# EAGLE board ewheel32 (EAGLE 7.7.0), part 1 of 2
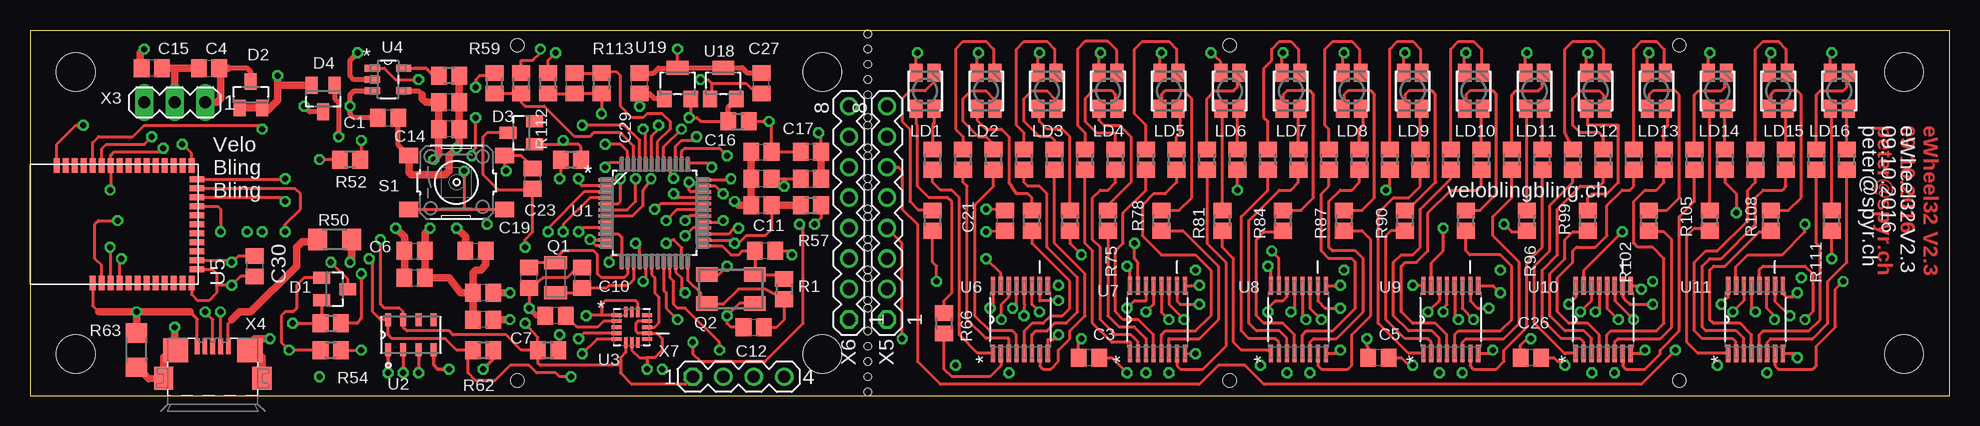
[diagram p2: board, top side]
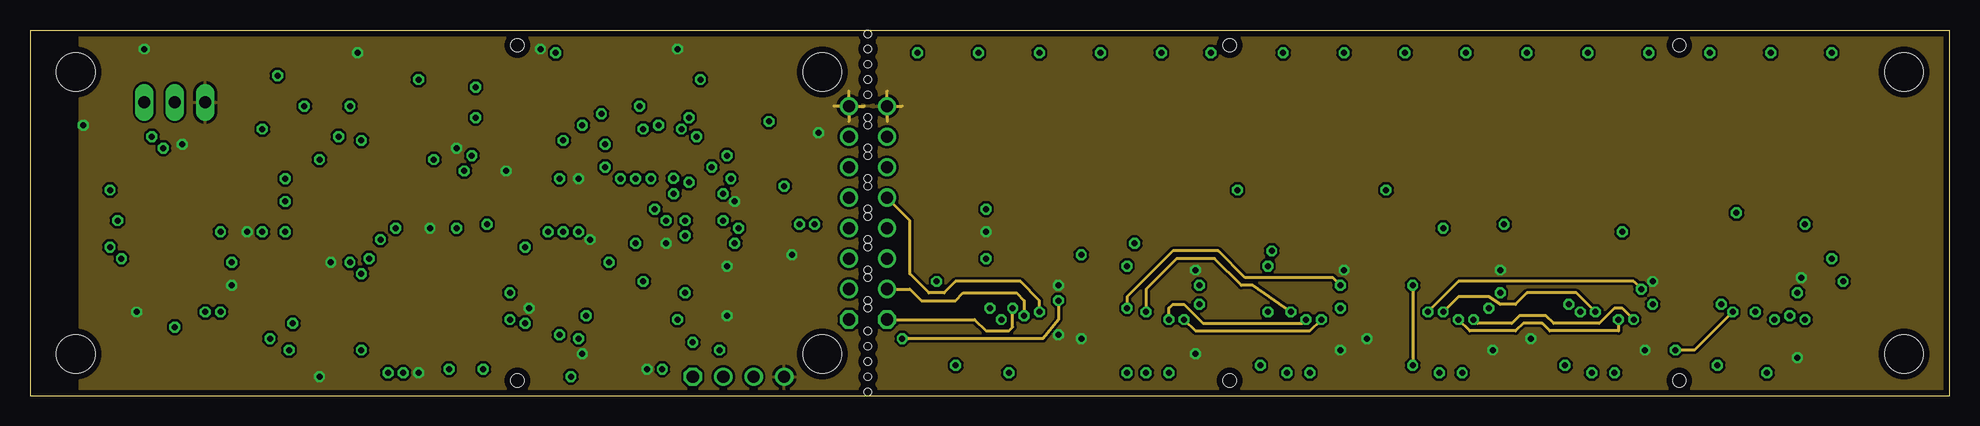
[diagram p3: board, inner layer GROUND]
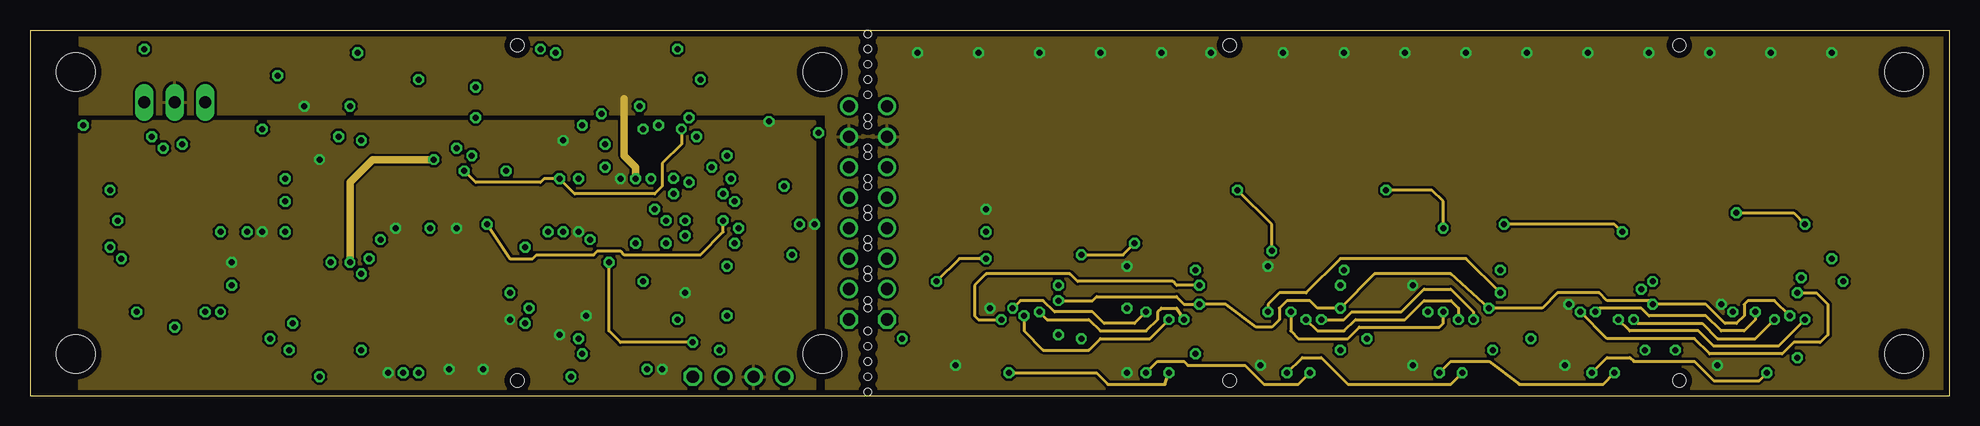
[diagram p4: board, inner layer POWER]
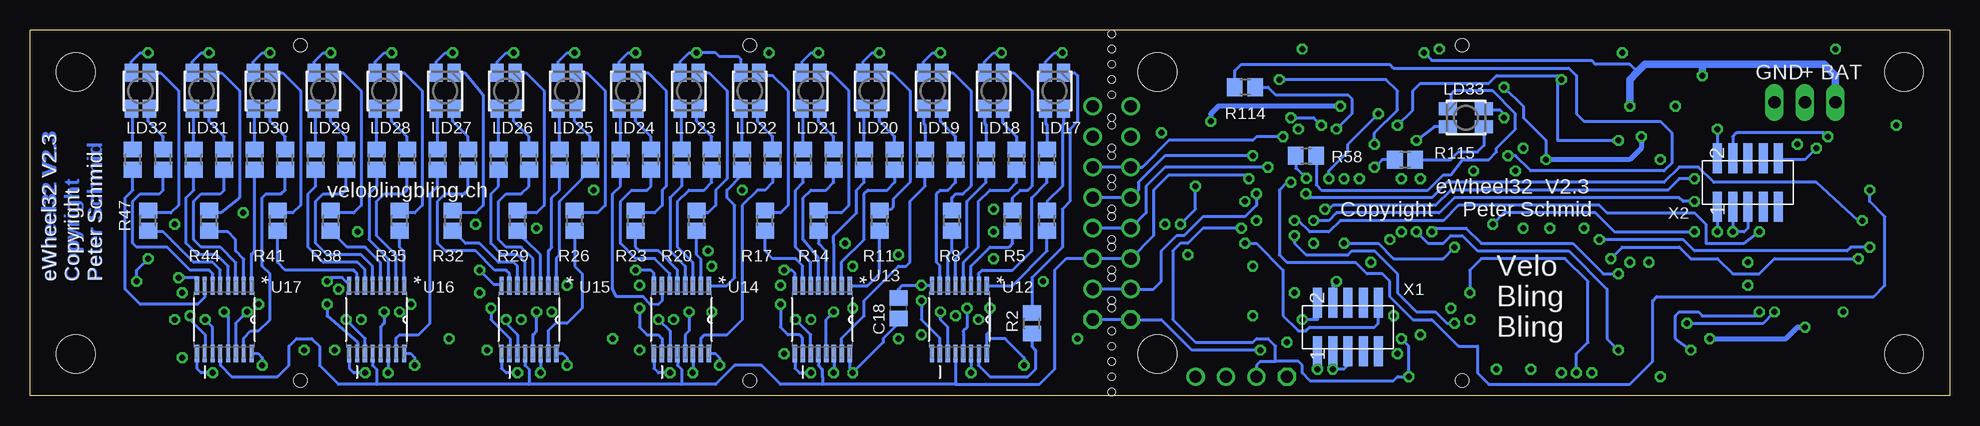
[diagram p5: board, bottom side, seen from below]

Size 160.02 x 30.48 mm. Coordinates in mm from the lower left corner, seen from the top.
Outline: 0,0 160.02,0 160.02,30.48 0,30.48 0,0
Copper layers (1+2*3+16): Top 0.035mm / dielectric 0.36mm / GROUND 0.035mm / dielectric 0.36mm / POWER 0.035mm / dielectric 0.36mm / Bottom 0.035mm
Design rules "default *": minimum track width 8mil, minimum drill 16mil, track to track 8mil, track to pad 8mil, pad to pad 8mil, via to via 8mil, smd to smd 8mil, copper to edge 20mil, drill to drill 8mil, minimum pad ring 10mil, minimum via ring 8mil, stop-mask expansion 4mil, vias tented up to drill 0mil, thermal gap 10mil
Net classes: 0 default: width 0.254 mm; 1 gnd: width 0.254 mm; 2 power: width 0.254 mm
Holes 3.2 mm at 3.81,3.49 3.81,26.99 156.21,3.49 156.21,26.99 66.04,3.49 66.04,26.99
Holes 1.1 mm at 40.64,29.21 40.64,1.27 100.01,29.21 100.01,1.27 137.48,29.21 137.48,1.27
Holes 0.6 mm at 69.85,25.08 69.85,22.54 69.85,20.64 69.85,18.1 69.85,15.56 69.85,13.02 69.85,10.48 69.85,7.94 69.85,26.35 69.85,27.62 69.85,4.13 69.85,2.86 69.85,28.89 69.85,30.16 69.85,23.18 69.85,20 69.85,17.46 69.85,14.92 69.85,12.38 69.85,9.84 69.85,7.3 69.85,1.59 69.85,0.32 69.85,5.4

## Footprints (pad centres in the part's own frame; a part is rotated, then mirrored left to right if it is on the bottom)
C0805 = smd 1.3 x 1.5: 1 -0.85,0; 2 0.85,0
SOT23 = smd 1 x 1.4: 1 -0.95,-1.1; 2 0.95,-1.1; 3 0,1.1
RGBLED-PLCC4 = smd 1.5 x 1.1: 1 -1.5,0.75; 2 -1.5,-0.75; 3 1.5,-0.75; 4 1.5,0.75
ABS07 = smd 1.1 x 1.9: P$1 -1.25,0; P$2 1.25,0
ABM3B = smd 1.8 x 1.2: 1 -1.993,-1.2; 2 1.993,-1.2; 3 1.993,1.2; 4 -1.993,1.2
R0805 = smd 1.3 x 1.5: 1 -0.85,0; 2 0.85,0
R1206 = smd 1.6 x 1.803: 1 -1.422,0; 2 1.422,0
B3S-1000 = smd 1.55 x 1.3: 1 -4,2.25; 2 4,2.25; 3 -4,-2.25; 4 4,-2.25
QFP50P900X900X160-48N = smd 1.041 x 0.279: 1 -4.166,2.743; 2 -4.166,2.261; 3 -4.166,1.753; 4 -4.166,1.245; 5 -4.166,0.762; 6 -4.166,0.254; 7 -4.166,-0.254; 8 -4.166,-0.762; 9 -4.166,-1.245; 10 -4.166,-1.753; 11 -4.166,-2.261; 12 -4.166,-2.743; 25 4.166,-2.743; 26 4.166,-2.261; 27 4.166,-1.753; 28 4.166,-1.245; 29 4.166,-0.762; 30 4.166,-0.254; 31 4.166,0.254; 32 4.166,0.762; 33 4.166,1.245; 34 4.166,1.753; 35 4.166,2.261; 36 4.166,2.743 | smd 0.279 x 1.041: 13 -2.743,-4.166; 14 -2.261,-4.166; 15 -1.753,-4.166; 16 -1.245,-4.166; 17 -0.762,-4.166; 18 -0.254,-4.166; 19 0.254,-4.166; 20 0.762,-4.166; 21 1.245,-4.166; 22 1.753,-4.166; 23 2.261,-4.166; 24 2.743,-4.166; 37 2.743,4.166; 38 2.261,4.166; 39 1.753,4.166; 40 1.245,4.166; 41 0.762,4.166; 42 0.254,4.166; 43 -0.254,4.166; 44 -0.762,4.166; 45 -1.245,4.166; 46 -1.753,4.166; 47 -2.261,4.166; 48 -2.743,4.166
DFN300X500X120-8N = smd 1.092 x 0.508: 1 -1.245,1.88; 2 -1.245,0.635; 3 -1.245,-0.635; 4 -1.245,-1.88; 5 1.245,-1.88; 6 1.245,-0.635; 7 1.245,0.635; 8 1.245,1.88
QFN50P300X300X100-16N = smd 0.864 x 0.305: 1 -1.27,0.991; 2 -1.27,0.508; 3 -1.27,0; 4 -1.27,-0.508; 5 -1.27,-0.991; 9 1.27,-0.991; 10 1.27,-0.508; 11 1.27,0; 12 1.27,0.508; 13 1.27,0.991 | smd 0.305 x 0.864: 6 -0.508,-1.27; 7 0,-1.27; 8 0.508,-1.27; 14 0.508,1.27; 15 0,1.27; 16 -0.508,1.27
SOT95P280X145-5N = smd 1.27 x 0.559: 1 -1.295,0.94; 2 -1.295,0; 3 -1.295,-0.94; 4 1.295,-0.94; 5 1.295,0.94
BL652 = smd 1.2 x 0.5: 1 4.9,4.8; 2 4.9,4.05; 3 4.9,3.3; 4 4.9,2.55; 5 4.9,1.8; 6 4.9,1.05; 7 4.9,0.3; 8 4.9,-0.45; 9 4.9,-1.2; 10 4.9,-1.95; 11 4.9,-2.7; 12 4.9,-3.45; 13 4.9,-4.2; 14 4.9,-4.95; 15 4.9,-5.7; 16 4.9,-6.45; 28 -4.9,-6.45; 29 -4.9,-5.7; 30 -4.9,-4.95; 31 -4.9,-4.2; 32 -4.9,-3.45; 33 -4.9,-2.7; 34 -4.9,-1.95; 35 -4.9,-1.2; 36 -4.9,-0.45; 37 -4.9,0.3; 38 -4.9,1.05; 39 -4.9,1.8 | smd 0.5 x 1.2: 17 3.75,-6.9; 18 3,-6.9; 19 2.25,-6.9; 20 1.5,-6.9; 21 0.75,-6.9; 22 0,-6.9; 23 -0.75,-6.9; 24 -1.5,-6.9; 25 -2.25,-6.9; 26 -3,-6.9; 27 -3.75,-6.9
SOP65P640X120-16N = smd 1.473 x 0.356: 1 -2.819,2.286; 2 -2.819,1.626; 3 -2.819,0.965; 4 -2.819,0.33; 5 -2.819,-0.33; 6 -2.819,-0.965; 7 -2.819,-1.626; 8 -2.819,-2.286; 9 2.819,-2.286; 10 2.819,-1.626; 11 2.819,-0.965; 12 2.819,-0.33; 13 2.819,0.33; 14 2.819,0.965; 15 2.819,1.626; 16 2.819,2.286
SOT23-W = smd 1.2 x 1.4: 1 -1.1,-1.3; 2 1.1,-1.3 | smd 1.8 x 1.2: 3 0,1.3
PIN-HEADER-NICRO-2-5-SMD = smd 2.5 x 0.75: P$1 -2.02,2.54; P$2 2.02,2.54; P$3 -2.02,1.27; P$4 2.02,1.27; P$5 -2.02,0; P$6 2.02,0; P$7 -2.02,-1.27; P$8 2.02,-1.27; P$9 -2.02,-2.54; P$10 2.02,-2.54
MA03-1 = drill 1.016 long: 1 -2.54,0; 2 0,0; 3 2.54,0
ZX62R-B-5P = smd 1.35 x 0.4: 1 2.675,-1.3; 2 2.675,-0.65; 3 2.675,0; 4 2.675,0.65; 5 2.675,1.3 | smd 1.9 x 1.6: M1 0,-4.1; M2 0,4.1 | smd 2 x 2.1: M3 2.35,3.1; M4 2.35,-3.1
MA08-1 = drill 1.016 octagon: 1 -8.89,0 | drill 1.016: 2 -6.35,0; 3 -3.81,0; 4 -1.27,0; 5 1.27,0; 6 3.81,0; 7 6.35,0; 8 8.89,0
MA04-1 = drill 1.016 octagon: 1 -3.81,0 | drill 1.016: 2 -1.27,0; 3 1.27,0; 4 3.81,0

## Placement (x,y rotation side)
C1  4.7u  [C0805]  29.84,23.18 0 top
C2  4.7u  [C0805]  34.92,24.45 180 top
C3  100n  [C0805]  88.27,3.17 180 top
C4  4.7u  [C0805]  14.92,27.3 0 top
C5  100n  [C0805]  112.39,3.17 180 top
C6  4.7u  [C0805]  32.07,12.06 0 top
C7  100n  [C0805]  37.78,6.35 180 top
C8  100n  [C0805]  37.78,8.57 180 top
C9  12p  [C0805]  41.59,9.84 90 top
C10  12p  [C0805]  46.04,9.84 270 top
C11  100n  [C0805]  60.96,15.88 180 top
C12  22p  [C0805]  60.33,5.71 0 top
C13  22p  [C0805]  61.28,12.06 180 top
C14  100n  [C0805]  34.92,22.23 180 top
C15  100n  [C0805]  10.16,27.3 180 top
C16  4.7u  [C0805]  60.96,20.32 0 top
C17  100n  [C0805]  65.09,20.32 180 top
C18  4.7u  [C0805]  87.63,7.3 90 bottom
C19  4.7u  [C0805]  37.15,12.06 0 top
C20  100n  [C0805]  45.4,26.04 90 top
C21  4.7u  [C0805]  81.28,14.61 270 top
C22  4.7u  [C0805]  60.96,18.1 180 top
C23  4.7u  [C0805]  41.91,18.1 90 top
C24  100n  [C0805]  65.09,18.1 0 top
C25  4.7u  [C0805]  32.07,9.84 0 top
C26  100n  [C0805]  125.09,3.17 180 top
C27  100n  [C0805]  60.96,26.04 90 top
C28  100n  [C0805]  43.81,6.67 180 top
C29  100n  [C0805]  50.8,26.04 90 top
C30  100n  [C0805]  18.73,10.79 270 top
D1  GSOT05C-E308  [SOT23]  25.4,8.89 270 top
D2  GSOT05C-E308  [SOT23]  18.41,25.08 0 top
D3  BAT54C  [SOT23]  40.96,21.91 90 top
D4  BAT54C  [SOT23]  24.45,24.77 180 top
LD1  CLV1A-FKB  [RGBLED-PLCC4]  74.61,25.4 270 top
LD2  CLV1A-FKB  [RGBLED-PLCC4]  79.69,25.4 270 top
LD3  CLV1A-FKB  [RGBLED-PLCC4]  84.77,25.4 270 top
LD4  CLV1A-FKB  [RGBLED-PLCC4]  89.85,25.4 270 top
LD5  CLV1A-FKB  [RGBLED-PLCC4]  94.93,25.4 270 top
LD6  CLV1A-FKB  [RGBLED-PLCC4]  100.01,25.4 270 top
LD7  CLV1A-FKB  [RGBLED-PLCC4]  105.09,25.4 270 top
LD8  CLV1A-FKB  [RGBLED-PLCC4]  110.17,25.4 270 top
LD9  CLV1A-FKB  [RGBLED-PLCC4]  115.25,25.4 270 top
LD10  CLV1A-FKB  [RGBLED-PLCC4]  120.33,25.4 270 top
LD11  CLV1A-FKB  [RGBLED-PLCC4]  125.41,25.4 270 top
LD12  CLV1A-FKB  [RGBLED-PLCC4]  130.49,25.4 270 top
LD13  CLV1A-FKB  [RGBLED-PLCC4]  135.57,25.4 270 top
LD14  CLV1A-FKB  [RGBLED-PLCC4]  140.65,25.4 270 top
LD15  CLV1A-FKB  [RGBLED-PLCC4]  145.73,25.4 270 top
LD16  CLV1A-FKB  [RGBLED-PLCC4]  150.81,25.4 270 top
LD17  CLV1A-FKB  [RGBLED-PLCC4]  74.61,25.4 270 bottom
LD18  CLV1A-FKB  [RGBLED-PLCC4]  79.69,25.4 270 bottom
LD19  CLV1A-FKB  [RGBLED-PLCC4]  84.77,25.4 270 bottom
LD20  CLV1A-FKB  [RGBLED-PLCC4]  89.85,25.4 270 bottom
LD21  CLV1A-FKB  [RGBLED-PLCC4]  94.93,25.4 270 bottom
LD22  CLV1A-FKB  [RGBLED-PLCC4]  100.01,25.4 270 bottom
LD23  CLV1A-FKB  [RGBLED-PLCC4]  105.09,25.4 270 bottom
LD24  CLV1A-FKB  [RGBLED-PLCC4]  110.17,25.4 270 bottom
LD25  CLV1A-FKB  [RGBLED-PLCC4]  115.25,25.4 270 bottom
LD26  CLV1A-FKB  [RGBLED-PLCC4]  120.33,25.4 270 bottom
LD27  CLV1A-FKB  [RGBLED-PLCC4]  125.41,25.4 270 bottom
LD28  CLV1A-FKB  [RGBLED-PLCC4]  130.49,25.4 270 bottom
LD29  CLV1A-FKB  [RGBLED-PLCC4]  135.57,25.4 270 bottom
LD30  CLV1A-FKB  [RGBLED-PLCC4]  140.65,25.4 270 bottom
LD31  CLV1A-FKB  [RGBLED-PLCC4]  145.73,25.4 270 bottom
LD32  CLV1A-FKB  [RGBLED-PLCC4]  150.81,25.4 270 bottom
LD33  CLV1A-FKB  [RGBLED-PLCC4]  40.32,23.18 0 bottom
Q1  32.768kHz  [ABS07]  43.81,9.84 90 top
Q2  8MHz  [ABM3B]  58.42,8.89 180 top
R1  1.0M  [R0805]  62.87,8.89 270 top
R2  220  [R0805]  76.52,6.03 90 bottom
R3  220  [R0805]  75.25,14.61 90 bottom
R4  220  [R0805]  75.25,19.68 90 bottom
R5  220  [R0805]  78.11,14.61 90 bottom
R6  220  [R0805]  77.79,19.68 90 bottom
R7  220  [R0805]  80.33,19.68 90 bottom
R8  220  [R0805]  83.19,14.61 90 bottom
R9  220  [R0805]  82.87,19.68 90 bottom
R10  220  [R0805]  85.41,19.68 90 bottom
R11  220  [R0805]  89.22,14.61 90 bottom
R12  220  [R0805]  87.95,19.68 90 bottom
R13  220  [R0805]  90.49,19.68 90 bottom
R14  220  [R0805]  94.3,14.61 90 bottom
R15  220  [R0805]  93.03,19.68 90 bottom
R16  220  [R0805]  95.57,19.68 90 bottom
R17  220  [R0805]  98.74,14.61 90 bottom
R18  220  [R0805]  98.11,19.68 90 bottom
R19  220  [R0805]  100.65,19.68 90 bottom
R20  220  [R0805]  104.46,14.61 90 bottom
R21  220  [R0805]  103.19,19.68 90 bottom
R22  220  [R0805]  105.73,19.68 90 bottom
R23  220  [R0805]  109.54,14.61 90 bottom
R24  220  [R0805]  108.27,19.68 90 bottom
R25  220  [R0805]  110.81,19.68 90 bottom
R26  220  [R0805]  114.62,14.61 90 bottom
R27  220  [R0805]  113.35,19.68 90 bottom
R28  220  [R0805]  115.89,19.68 90 bottom
R29  220  [R0805]  119.38,14.61 90 bottom
R30  220  [R0805]  118.43,19.68 90 bottom
R31  220  [R0805]  120.97,19.68 90 bottom
R32  220  [R0805]  124.78,14.61 90 bottom
R33  220  [R0805]  123.51,19.68 90 bottom
R34  220  [R0805]  126.05,19.68 90 bottom
R35  220  [R0805]  129.22,14.61 90 bottom
R36  220  [R0805]  128.59,19.68 90 bottom
R37  220  [R0805]  131.13,19.68 90 bottom
R38  220  [R0805]  134.94,14.61 90 bottom
R39  220  [R0805]  133.67,19.68 90 bottom
R40  220  [R0805]  136.21,19.68 90 bottom
R41  220  [R0805]  139.38,14.61 90 bottom
R42  220  [R0805]  138.75,19.68 90 bottom
R43  220  [R0805]  141.29,19.68 90 bottom
R44  220  [R0805]  145.1,14.61 90 bottom
R45  220  [R0805]  143.83,19.68 90 bottom
R46  220  [R0805]  146.37,19.68 90 bottom
R47  220  [R0805]  150.18,14.61 90 bottom
R48  220  [R0805]  148.91,19.68 90 bottom
R49  100k  [R0805]  45.09,19.68 0 top
R50  330  [R1206]  25.4,13.02 0 top
R51  4.7k  [R0805]  34.92,26.67 180 top
R52  100k  [R0805]  26.67,19.68 180 top
R53  100k  [R0805]  59.05,22.86 0 top
R54  33  [R0805]  25.08,3.81 0 top
R55  33  [R0805]  25.08,6.03 0 top
R56  220  [R0805]  151.45,19.68 90 bottom
R57  10k  [R0805]  65.09,15.88 0 top
R58  220  [R0805]  53.66,20 0 bottom
R59  100k  [R0805]  38.73,26.04 90 top
R60  100k  [R0805]  40.96,26.04 90 top
R61  4.7k  [R0805]  43.18,3.81 0 top
R62  4.7k  [R0805]  37.78,3.81 0 top
R63  330  [R1206]  8.89,3.81 270 top
R64  220  [R0805]  75.25,14.61 90 top
R65  220  [R0805]  75.25,19.68 90 top
R66  220  [R0805]  76.2,6.03 90 top
R67  220  [R0805]  77.79,19.68 90 top
R68  220  [R0805]  80.33,19.68 90 top
R69  220  [R0805]  83.5,14.61 90 top
R70  220  [R0805]  82.87,19.68 90 top
R71  220  [R0805]  85.41,19.68 90 top
R72  220  [R0805]  86.68,14.61 90 top
R73  220  [R0805]  87.95,19.68 90 top
R74  220  [R0805]  90.49,19.68 90 top
R75  220  [R0805]  89.85,14.61 90 top
R76  220  [R0805]  93.03,19.68 90 top
R77  220  [R0805]  95.57,19.68 90 top
R78  220  [R0805]  94.3,14.61 90 top
R79  220  [R0805]  98.11,19.68 90 top
R80  220  [R0805]  100.65,19.68 90 top
R81  220  [R0805]  99.38,14.61 90 top
R82  220  [R0805]  103.19,19.68 90 top
R83  220  [R0805]  105.73,19.68 90 top
R84  220  [R0805]  104.46,14.61 90 top
R85  220  [R0805]  108.27,19.68 90 top
R86  220  [R0805]  110.81,19.68 90 top
R87  220  [R0805]  109.54,14.61 90 top
R88  220  [R0805]  113.35,19.68 90 top
R89  220  [R0805]  115.89,19.68 90 top
R90  220  [R0805]  114.62,14.61 90 top
R91  220  [R0805]  118.43,19.68 90 top
R92  220  [R0805]  120.97,19.68 90 top
R93  220  [R0805]  119.7,14.61 90 top
R94  220  [R0805]  123.51,19.68 90 top
R95  220  [R0805]  126.05,19.68 90 top
R96  220  [R0805]  124.78,14.61 90 top
R97  220  [R0805]  128.59,19.68 90 top
R98  220  [R0805]  131.13,19.68 90 top
R99  220  [R0805]  129.86,14.61 90 top
R100  220  [R0805]  133.67,19.68 90 top
R101  220  [R0805]  136.21,19.68 90 top
R102  220  [R0805]  134.94,14.61 90 top
R103  220  [R0805]  138.75,19.68 90 top
R104  220  [R0805]  141.29,19.68 90 top
R105  220  [R0805]  140.02,14.61 90 top
R106  220  [R0805]  143.83,19.68 90 top
R107  220  [R0805]  146.37,19.68 90 top
R108  220  [R0805]  145.1,14.61 90 top
R109  220  [R0805]  148.91,19.68 90 top
R110  220  [R0805]  151.45,19.68 90 top
R111  220  [R0805]  150.18,14.61 90 top
R112  10k  [R0805]  43.18,26.04 90 top
R113  2.2k  [R0805]  47.62,26.04 270 top
R114  220  [R0805]  58.74,25.72 180 bottom
R115  220  [R0805]  45.4,19.68 0 bottom
S1  B3F-1000  [B3S-1000]  35.56,17.78 0 top
U1  MK22DX256VLF5  [QFP50P900X900X160-48N]  52.07,15.24 0 top
U2  MPL3115A2  [DFN300X500X120-8N]  31.75,5.08 90 top
U3  MMA8451QR1  [QFN50P300X300X100-16N]  50.16,5.71 0 top
U4  MCP73832T-2ACI/OT  [SOT95P280X145-5N]  29.84,26.35 0 top
U5  BL652  [BL652]  7.01,14.29 90 top
U6  MC74HC595ADTR2G  [SOP65P640X120-16N]  82.55,6.35 90 top
U7  MC74HC595ADTR2G  [SOP65P640X120-16N]  93.98,6.35 90 top
U8  MC74HC595ADTR2G  [SOP65P640X120-16N]  105.73,6.35 90 top
U9  MC74HC595ADTR2G  [SOP65P640X120-16N]  118.43,6.35 90 top
U10  MC74HC595ADTR2G  [SOP65P640X120-16N]  131.13,6.35 90 top
U11  MC74HC595ADTR2G  [SOP65P640X120-16N]  143.83,6.35 90 top
U12  MC74HC595ADTR2G  [SOP65P640X120-16N]  82.55,6.35 270 bottom
U13  MC74HC595ADTR2G  [SOP65P640X120-16N]  93.98,6.35 270 bottom
U14  MC74HC595ADTR2G  [SOP65P640X120-16N]  105.73,6.35 270 bottom
U15  MC74HC595ADTR2G  [SOP65P640X120-16N]  118.43,6.35 270 bottom
U16  MC74HC595ADTR2G  [SOP65P640X120-16N]  131.13,6.35 270 bottom
U17  MC74HC595ADTR2G  [SOP65P640X120-16N]  143.83,6.35 270 bottom
U18  A3213LH  [SOT23-W]  57.78,26.04 0 top
U19  A3214LH  [SOT23-W]  53.98,26.04 0 top
X1  PIN-HEADER-MICRO-2-5-SMD  [PIN-HEADER-NICRO-2-5-SMD]  50.16,5.71 90 bottom
X2  PIN-HEADER-MICRO-2-5-SMD  [PIN-HEADER-NICRO-2-5-SMD]  16.83,17.78 90 bottom
X3  [MA03-1]  12.06,24.45 180 top
X4  MICRO-USB-SHIELD-ZX62R-B-5P  [ZX62R-B-5P]  15.24,1.45 90 top
X5  [MA08-1]  71.44,15.24 90 top
X6  [MA08-1]  68.26,15.24 90 top
X7  [MA04-1]  59.05,1.59 0 top